# EAGLE design Spændingsregulator V1.0 (EAGLE 7.1.0)
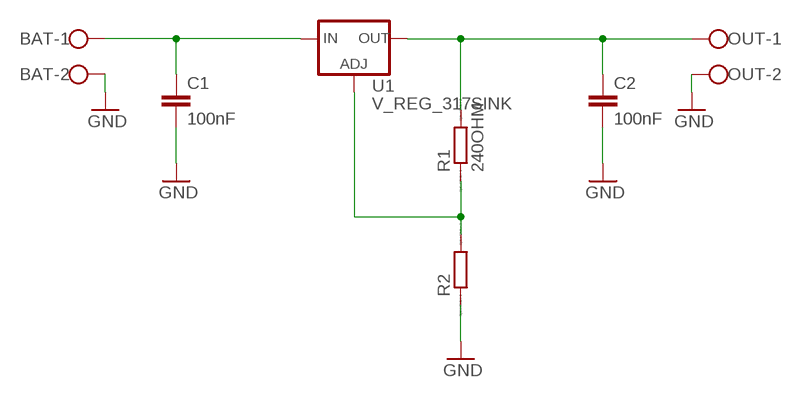
[diagram p0: schematic, sheet 1]

## Parts
BAT  W237-102  [W237-102]
C1  100nF  C7.5/3  [C7.5B3]
C2  100nF  C7.5/3  [C7.5B3]
OUT  W237-102  [W237-102]
R1  240OHM  R-EU_0204_5  [0204/5]
R2  R-EU_0204_5  [0204/5]
U1  V_REG_317SINK  [TO220-ADJ]

## Nets
GND: BAT.2 C1.2 C2.2 OUT.2 R2.1
N$1: C2.1 OUT.1 R1.2 U1.OUT
N$2: R1.1 R2.2 U1.ADJ
N$3: BAT.1 C1.1 U1.IN

## Library data of the parts
BAT OUT = con-wago-500:W237-102: WAGO SCREW CLAMP; MPN: 237-102; OC_FARNELL: unknown; OC_NEWARK: 70K9898
C1 C2 = capacitor-wima:C: CAPACITOR naming: grid - package width
R1 R2 = resistor:R-EU_: RESISTOR, European symbol; SPICEPREFIX: R
U1 = SparkFun-PowerIC:V_REG_317: Voltage Regulator Standard LM317 adjustable voltage regulator. AOI (Adjust Output Input). Google 'LM317 Calculator' for easy to use app to get the two resistor values needed. 240/720 for 5V output. 240/390 for 3.3V output. Spark Fun Electronics SKU : COM-00527

## Board
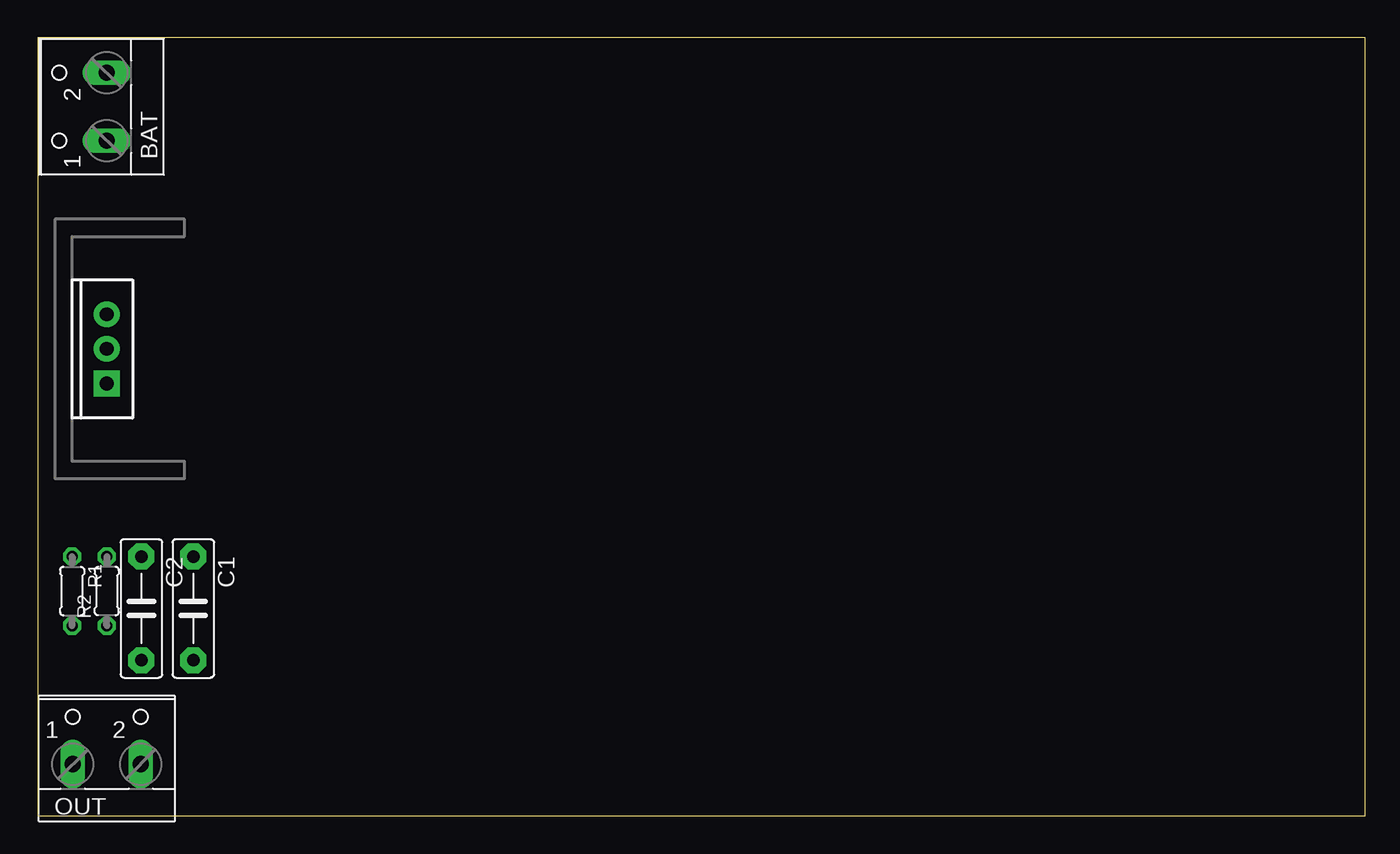
[diagram p1: board, top side]
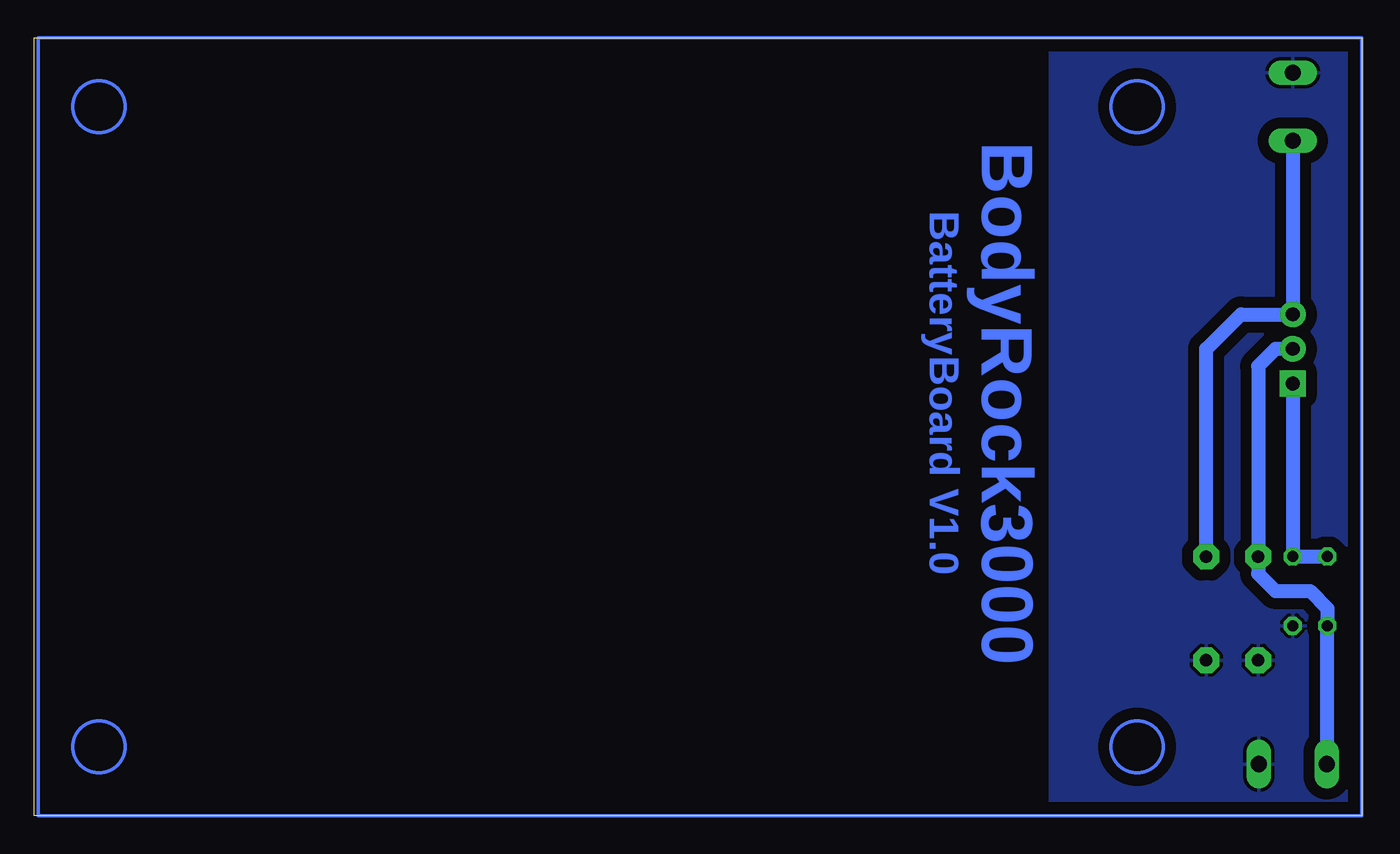
[diagram p2: board, bottom side, seen from below]

Size 97.46 x 57.14 mm. Coordinates in mm from the lower left corner, seen from the top.
Outline: 0,0 97.46,0 97.46,57.14 0,57.14 0,0
Copper layers (1*16): Top 0.035mm / dielectric 1.5mm / Bottom 0.035mm
Design rules "default": minimum track width 10mil, minimum drill 24mil, track to track 8mil, track to pad 8mil, pad to pad 8mil, via to via 8mil, smd to smd 8mil, copper to edge 40mil, drill to drill 8mil, minimum pad ring 10mil, minimum via ring 8mil, stop-mask expansion 4mil, vias tented up to drill 0mil, thermal gap 10mil

### Footprints (pad centres in the part's own frame; a part is rotated, then mirrored left to right if it is on the bottom)
W237-102 = drill 1.194 long: 1 -2.5,-1.27; 2 2.5,-1.27
C7.5B3 = drill 0.914 pad 1.905 octagon: 1 -3.81,0; 2 3.81,0
0204/5 = drill 0.813 octagon: 1 -2.54,0; 2 2.54,0
TO220-ADJ = drill 1 pad 1.88 square: ADJ -2.54,0 | drill 1 pad 1.88: IN 2.54,0; OUT 0,0

### Placement (x,y rotation side)
BAT  3.81,52.07 90 top
C1  11.43,15.24 270 top
C2  7.62,15.24 270 top
OUT  5.08,5.08 0 top
R1  2.54,16.51 270 top
R2  5.08,16.51 90 top
U1  5.08,34.29 90 top

### Tracks (layer width: path | path; a pad name or v marks a point on that pad's centre or on a via)
GND
  pour Bottom (isolate 0.813): 0,57.15 22.86,57.15 22.86,0 0,0
N$1
  Bottom 1.016: OUT.1 2.58,13.97 R1.2 2.54,15.24 3.81,16.51 6.35,16.51 7.62,17.78 C2.1 7.62,33.02 6.35,34.29 U1.OUT
N$2
  Bottom 1.016: R1.1 R2.2 U1.ADJ
N$3
  Bottom 1.016: C1.1 11.43,34.29 8.89,36.83 U1.IN BAT.1
N$4
  Bottom 0.254: 0,57.15 97.16,57.15 97.16,0 0,0 0,57.15
(copper drawn outside any net)
  shapes: Bottom circle x4

### Text on the board
Bottom: BodyRock3000 | BatteryBoard V1.0